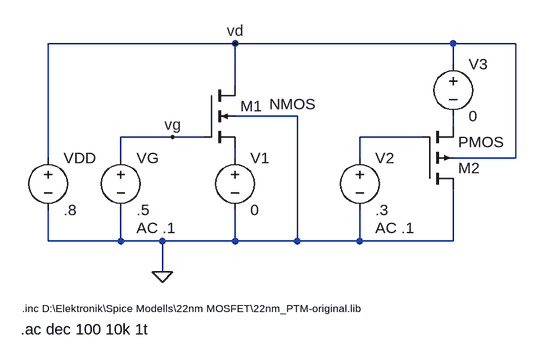
[diagram p0: schematic transit_freq.asc]
transit_freq.asc, the LTspice schematic file:
Version 4
SHEET 1 1052 680
WIRE 208 0 -80 0
WIRE 544 0 208 0
WIRE 640 0 544 0
WIRE 544 32 544 0
WIRE 208 64 208 0
WIRE 304 112 208 112
WIRE 544 128 544 112
WIRE 112 144 32 144
WIRE 160 144 112 144
WIRE 496 144 400 144
WIRE -80 176 -80 0
WIRE 32 176 32 144
WIRE 208 176 208 160
WIRE 400 176 400 144
WIRE 640 176 640 0
WIRE 640 176 544 176
WIRE -80 304 -80 256
WIRE 32 304 32 256
WIRE 32 304 -80 304
WIRE 96 304 32 304
WIRE 208 304 208 256
WIRE 208 304 96 304
WIRE 304 304 304 112
WIRE 304 304 208 304
WIRE 400 304 400 256
WIRE 400 304 304 304
WIRE 544 304 544 224
WIRE 544 304 400 304
WIRE 96 352 96 304
FLAG 96 352 0
FLAG 208 0 vd
FLAG 112 144 vg
SYMBOL voltage -80 160 R0
WINDOW 123 0 0 Left 2
WINDOW 39 24 124 Left 2
SYMATTR InstName VDD
SYMATTR Value .8
SYMBOL voltage 32 160 R0
WINDOW 123 24 124 Left 2
WINDOW 39 24 124 Left 2
SYMATTR InstName VG
SYMATTR Value .5
SYMATTR Value2 AC .1
SYMBOL nmos4 160 64 R0
WINDOW 3 101 29 Left 2
SYMATTR InstName M1
SYMATTR Value2 l=22n w=44n
SYMBOL voltage 208 160 R0
SYMATTR InstName V1
SYMATTR Value 0
SYMBOL pmos4 496 224 M180
SYMATTR InstName M2
SYMATTR Value2 l=22n w=44n
SYMBOL voltage 400 160 R0
WINDOW 123 24 124 Left 2
WINDOW 39 0 0 Left 2
SYMATTR InstName V2
SYMATTR Value .3
SYMATTR Value2 AC .1
SYMBOL voltage 544 16 R0
SYMATTR InstName V3
SYMATTR Value 0
TEXT -120 408 Left 1 !.inc D:\\Elektronik\\Spice Modells\\22nm MOSFET\\22nm_PTM-original.lib
TEXT -122 440 Left 2 !.ac dec 100 10k 1t

The netlist it stands for:
* transit_freq.asc
VDD vd 0 .8
VG vg 0 .5 AC .1
M1 vd vg N003 0 NMOS l=22n w=44n
V1 N003 0 0
M2 0 N002 N001 vd PMOS l=22n w=44n
V2 N002 0 .3 AC .1
V3 vd N001 0
.model NMOS NMOS
.model PMOS PMOS
.lib standard.mos
.inc D:\Elektronik\Spice Modells\22nm MOSFET\22nm_PTM-original.lib
.ac dec 100 10k 1t
.backanno
.end